# Altium schematic sheet TestBoard.SchDoc
size A4; SheetNumber: 1; SheetTotal: 6
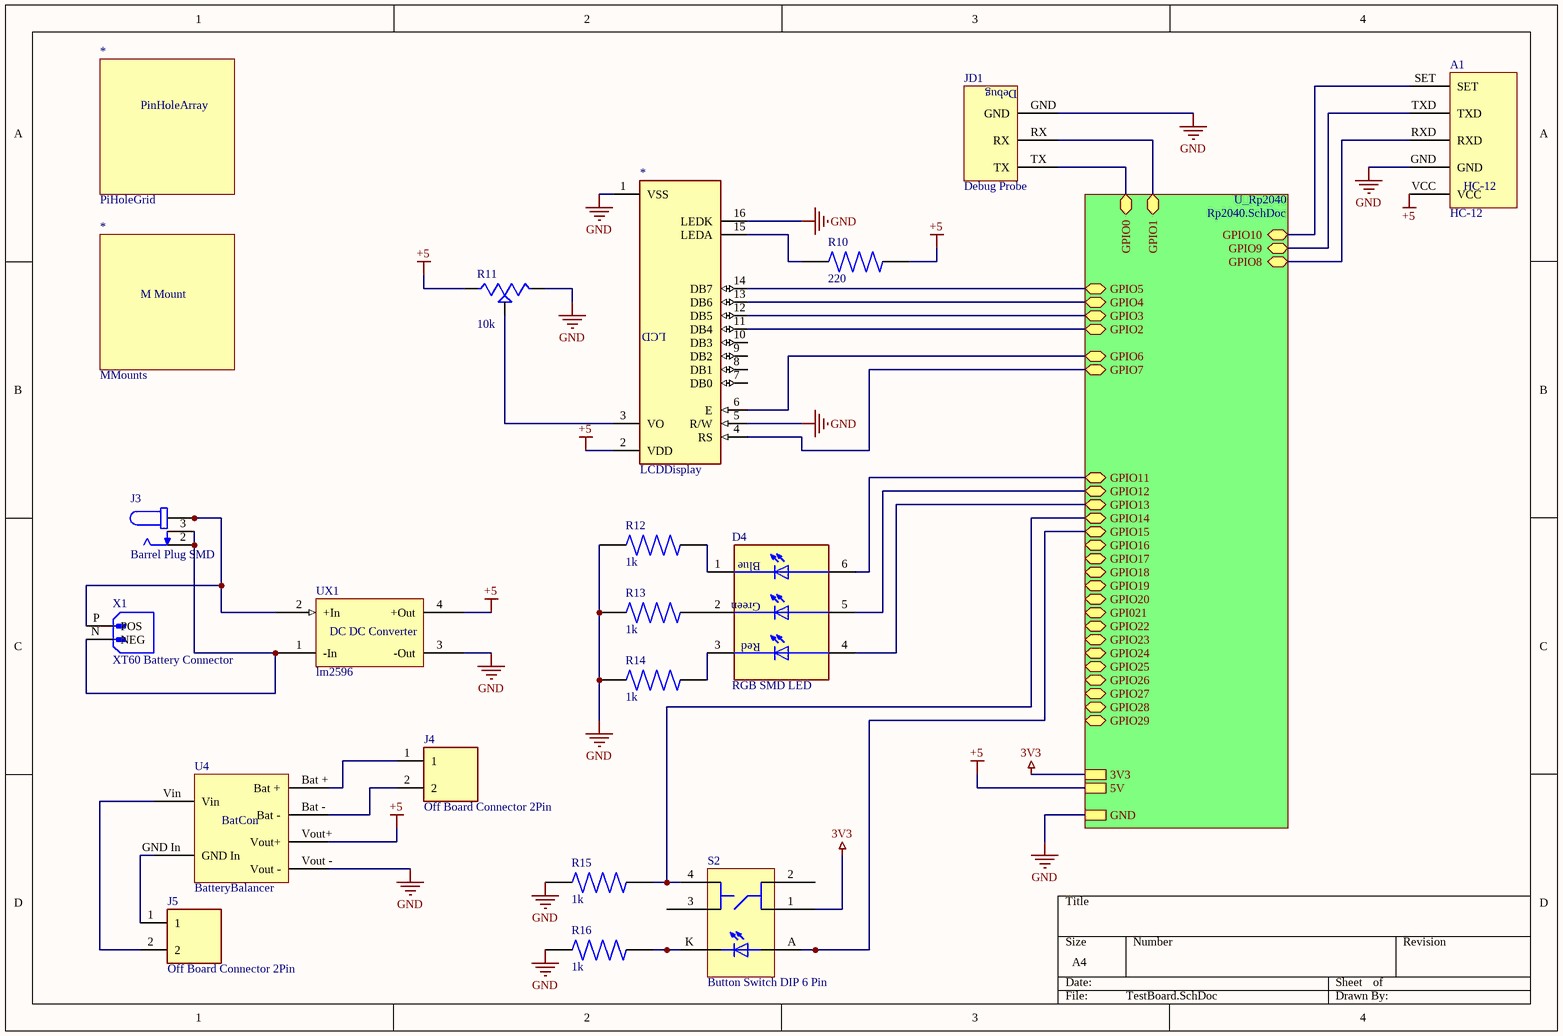
[diagram p0: TestBoard.SchDoc]

## Parts
(Parts that share a designator on the sheet are numbered #1, #2 ... from top to bottom, then left to right.)
*#1  PiHoleGrid  [PinHoleGrid]
*#2  LCDDisplay  [LCDDisplay]
*#3  MMounts  [M Mount]
A1  HC-12  [HC-12]
D4  RGB SMD LED  [SMD RGB LED]
J3  Barrel Plug SMD  [Barrel Plug SMD]
J4  Off Board Connector 2Pin  [OFF BORAD CONNECTOR 2PIN]
J5  Off Board Connector 2Pin  [OFF BORAD CONNECTOR 2PIN]
JD1  Debug Probe  [DebugProbe]
R10  220  [Resistor]
R11  10k  [Poti 3296]
R12  1k  [SMD Resistor]
R13  1k  [SMD Resistor]
R14  1k  [SMD Resistor]
R15  1k  [Resistor]
R16  1k  [Resistor]
S2  Button Switch DIP 6 Pin  [Button Switch DIP 6 Pin]
U4  BatteryBalancer  [BatteryBalancer]
UX1  lm2596  [LM2596]
X1  XT60 Battery Connector  [XT60 Battery Connector]

## Sub-sheets
U_Rp2040 = Rp2040.SchDoc: GPIO0 (bidir), GPIO1 (bidir), GPIO2 (bidir), GPIO3 (bidir), GPIO4 (bidir), GPIO5 (bidir), GPIO6 (bidir), GPIO7 (bidir), GPIO8 (bidir), GPIO9 (bidir), GPIO10 (bidir), GPIO11 (bidir), GPIO12 (bidir), GPIO13 (bidir), GPIO14 (bidir), GPIO15 (bidir), GPIO16 (bidir), GPIO17 (bidir), GPIO18 (bidir), GPIO19 (bidir), GPIO20 (bidir), GPI021 (bidir), GPIO22 (bidir), GPIO23 (bidir), GPIO24 (bidir), GPIO25 (bidir), GPIO26 (bidir), GPIO27 (bidir), GPIO28 (bidir), GPIO29 (bidir), 3V3, 5V, GND

## Nets
3V3: S2.1 ; sheet U_Rp2040/3V3
+5: *#2.2(VDD) A1.VCC R10.2 R11.1(CCW) U4.Vout+ UX1.4(+Out) ; sheet U_Rp2040/5V
GND: *#2.1(VSS) *#2.5(R/W) *#2.16(LEDK) A1.GND JD1.GND R11.3(CW) R12.1 R13.1 R14.1 R15.1 R16.1 U4.Vout_- UX1.3(-Out) ; sheet U_Rp2040/GND
Net*#2_3: *#2.3(VO) R11.2(WIPER)
Net*#2_4: *#2.4(RS) ; sheet U_Rp2040/GPIO7
Net*#2_6: *#2.6(E) ; sheet U_Rp2040/GPIO6
Net*#2_11: *#2.11(DB4) ; sheet U_Rp2040/GPIO2
Net*#2_12: *#2.12(DB5) ; sheet U_Rp2040/GPIO3
Net*#2_13: *#2.13(DB6) ; sheet U_Rp2040/GPIO4
Net*#2_14: *#2.14(DB7) ; sheet U_Rp2040/GPIO5
Net*#2_15: *#2.15(LEDA) R10.1
NetA1_RXD: A1.RXD ; sheet U_Rp2040/GPIO8
NetA1_SET: A1.SET ; sheet U_Rp2040/GPIO10
NetA1_TXD: A1.TXD ; sheet U_Rp2040/GPIO9
NetD4_1: D4.1 R12.2
NetD4_2: D4.2 R13.2
NetD4_3: D4.3 R14.2
NetD4_4: D4.4 ; sheet U_Rp2040/GPIO13
NetD4_5: D4.5 ; sheet U_Rp2040/GPIO12
NetD4_6: D4.6 ; sheet U_Rp2040/GPIO11
NetJ3_1A: J3.1A J3.1B UX1.2(+In) X1.P(POS)
NetJ3_2: J3.2 J3.3 UX1.1(-In) X1.N(NEG)
NetJ4_1: J4.1 U4.Bat_+
NetJ4_2: J4.2 U4.Bat_-
NetJ5_1: J5.1 U4.GND_In
NetJ5_2: J5.2 U4.Vin
NetJD1_RX: JD1.RX ; sheet U_Rp2040/GPIO1
NetJD1_TX: JD1.TX ; sheet U_Rp2040/GPIO0
NetR15_2: R15.2 S2.4 ; sheet U_Rp2040/GPIO14
NetR16_2: R16.2 S2.K
NetS2_A: S2.A ; sheet U_Rp2040/GPIO15

Not connected (* = marked no-connect by the designer): *#2 7(DB0) 8(DB1) 9(DB2) 10(DB3); S2 2 3

## Notes on the sheet
- (in symbol BatteryBalancer) BatCon
- (in symbol Debug Probe) Debug
- (in symbol LCDDisplay) LCD
- (in symbol lm2596) DC DC Converter
- (in symbol MMounts) M Mount
- (in symbol PiHoleGrid) PinHoleArray
- (in symbol RGB SMD LED) Blue; Green; Red

## Library data of the parts
J4 J5 = Off Board Connector 2Pin: Screw Connector
R10 R15 R16 = Resistor
R11 = Poti 3296
R12-R14 = SMD Resistor